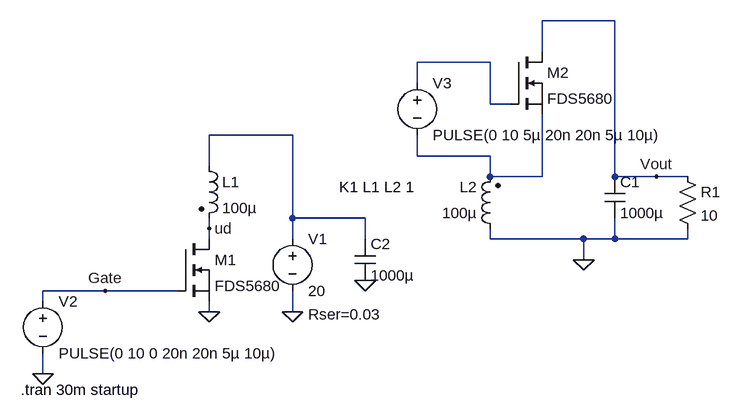
[diagram p0: schematic flyback.asc]
flyback.asc, the LTspice schematic file:
Version 4
SHEET 1 1272 680
WIRE 1104 -256 992 -256
WIRE 992 -208 992 -256
WIRE 912 -192 800 -192
WIRE 800 -160 800 -192
WIRE 912 -128 912 -192
WIRE 944 -128 912 -128
WIRE 608 -80 480 -80
WIRE 800 -48 800 -80
WIRE 912 -48 800 -48
WIRE 480 -32 480 -80
WIRE 912 -16 912 -48
WIRE 992 -16 992 -112
WIRE 992 -16 912 -16
WIRE 1104 -16 1104 -256
WIRE 1168 -16 1104 -16
WIRE 1216 -16 1168 -16
WIRE 608 48 608 -80
WIRE 720 48 608 48
WIRE 480 64 480 48
WIRE 480 80 480 64
WIRE 608 80 608 48
WIRE 720 80 720 48
WIRE 912 80 912 64
WIRE 1056 80 912 80
WIRE 1104 80 1104 48
WIRE 1104 80 1056 80
WIRE 1216 80 1216 64
WIRE 1216 80 1104 80
WIRE 1056 112 1056 80
WIRE 320 160 224 160
WIRE 432 160 320 160
WIRE 224 176 224 160
WIRE 480 192 480 176
WIRE 608 192 608 160
WIRE 224 288 224 256
FLAG 608 192 0
FLAG 480 192 0
FLAG 224 288 0
FLAG 1056 112 0
FLAG 1168 -16 Vout
FLAG 320 160 Gate
FLAG 720 144 0
FLAG 480 64 ud
SYMBOL voltage 608 64 R0
WINDOW 123 0 0 Left 0
WINDOW 39 24 132 Left 0
SYMATTR InstName V1
SYMATTR Value 20
SYMATTR SpiceLine Rser=0.03
SYMBOL nmos 432 80 R0
SYMATTR InstName M1
SYMATTR Value FDS5680
SYMBOL ind2 464 -48 R0
SYMATTR InstName L1
SYMATTR Value 100µ
SYMATTR Type ind
SYMATTR SpiceLine Rser=0
SYMBOL voltage 224 160 R0
WINDOW 123 0 0 Left 0
WINDOW 39 0 0 Left 0
SYMATTR InstName V2
SYMATTR Value PULSE(0 10 0 20n 20n 5µ 10µ)
SYMBOL ind2 928 80 R180
WINDOW 0 36 80 Left 0
WINDOW 3 36 40 Left 0
SYMATTR InstName L2
SYMATTR Value 100µ
SYMATTR Type ind
SYMBOL cap 1088 -16 R0
SYMATTR InstName C1
SYMATTR Value 1000µ
SYMBOL res 1200 -32 R0
SYMATTR InstName R1
SYMATTR Value 10
SYMBOL nmos 944 -208 R0
SYMATTR InstName M2
SYMATTR Value FDS5680
SYMBOL voltage 800 -176 R0
WINDOW 123 0 0 Left 0
WINDOW 39 0 0 Left 0
SYMATTR InstName V3
SYMATTR Value PULSE(0 10 5µ 20n 20n 5µ 10µ)
SYMBOL cap 704 80 R0
SYMATTR InstName C2
SYMATTR Value 1000µ
TEXT 680 0 Left 0 !K1 L1 L2 1
TEXT 190 312 Left 0 !.tran 30m startup

The netlist it stands for:
* flyback.asc
V1 N002 0 20 Rser=0.03
M1 ud Gate 0 0 FDS5680
L1 N002 ud 100µ Rser=0
V2 Gate 0 PULSE(0 10 0 20n 20n 5µ 10µ)
L2 0 N003 100µ
C1 Vout 0 1000µ
R1 Vout 0 10
M2 Vout N001 N003 N003 FDS5680
V3 N001 N003 PULSE(0 10 5µ 20n 20n 5µ 10µ)
C2 N002 0 1000µ
.model NMOS NMOS
.model PMOS PMOS
.lib standard.mos
K1 L1 L2 1
.tran 30m startup
.backanno
.end